# Altium schematic sheet Signals2uC.SchDoc
size A4
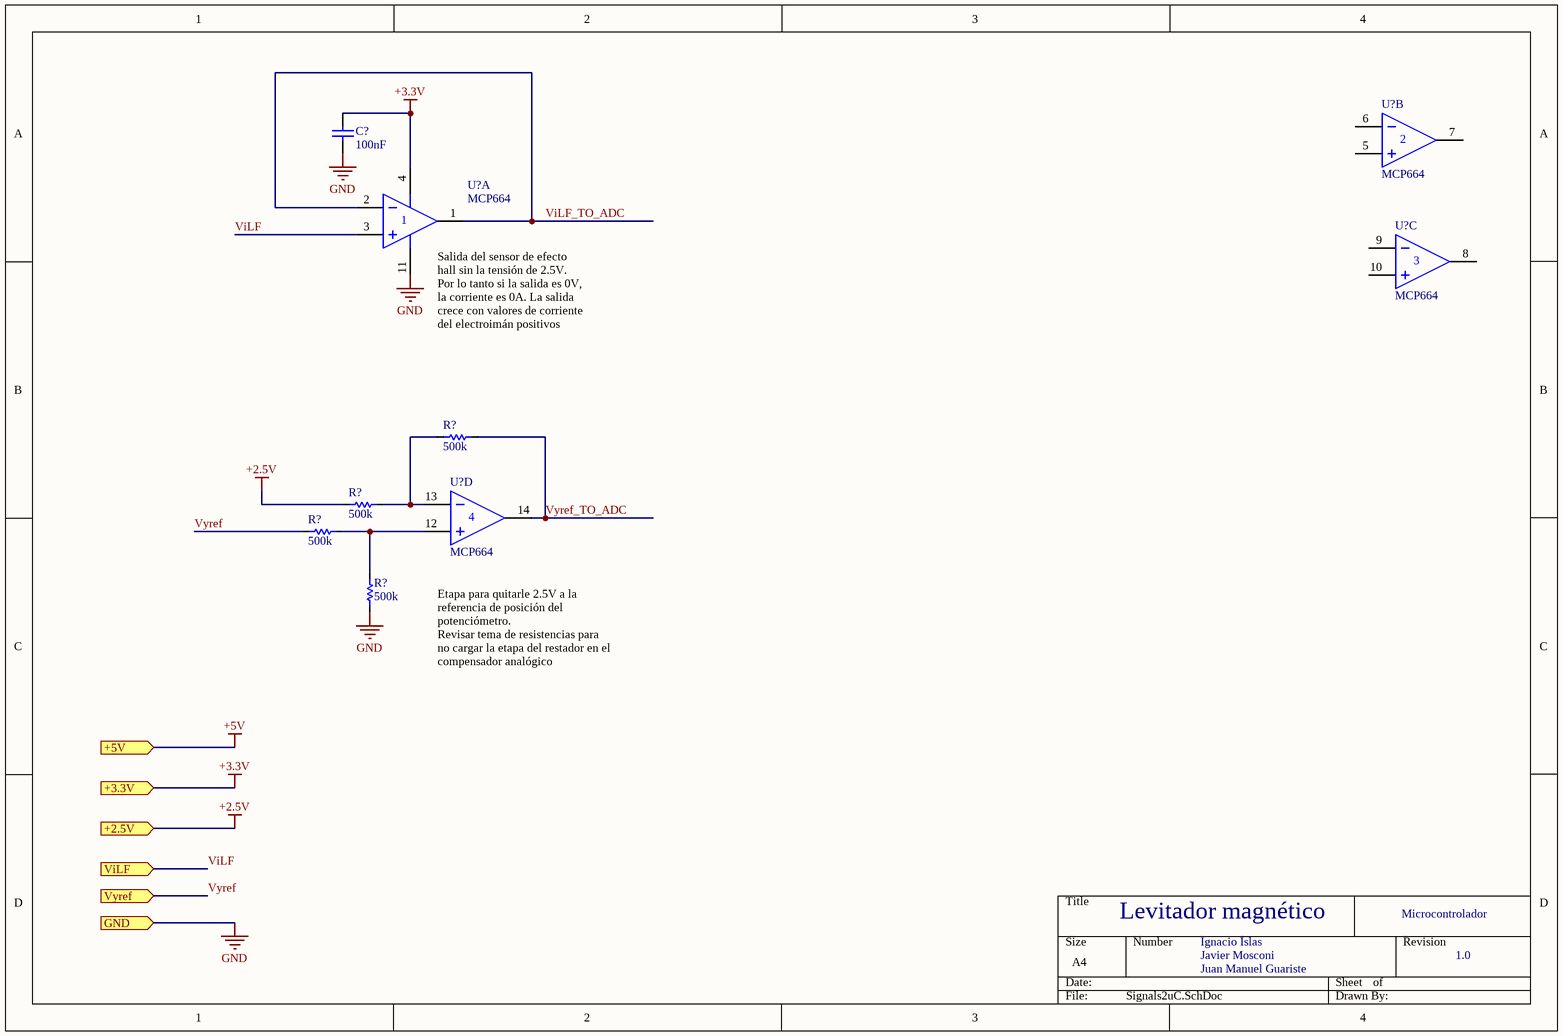
[diagram p0: Signals2uC.SchDoc]

## Parts
(Parts that share a designator on the sheet are numbered #1, #2 ... from top to bottom, then left to right.)
C?  value 100nF  [R2012-0805]  (hidden comment: Capacitor)
R?#1  value 500k  [1206]  (hidden comment: Resistencia)
R?#2  value 500k  [1206]  (hidden comment: Resistencia)
R?#3  value 500k  [1206]  (hidden comment: Resistencia)
R?#4  value 500k  [1206]  (hidden comment: Resistencia)
U?#1  MCP664  [SOIC14]  (part B of 4)
U?#2  MCP664  [SOIC14]  (part A of 4)
U?#3  MCP664  [SOIC14]  (part C of 4)
U?#4  MCP664  [SOIC14]  (part D of 4)

## Ports
+2.5V (in), +3.3V (in), +5V (in), GND (in), ViLF (in), Vyref (in)

## Nets
+2.5V: R?#2.2 ; port +2.5V
+3.3V: C?.1 U?#2.4(V+) ; port +3.3V
+5V: port +5V
GND: C?.2 R?#4.1 U?#2.11(V-) ; port GND
ViLF: U?#2.3(IN+) ; port ViLF
ViLF_TO_ADC: U?#2.1(OUT) U?#2.2(IN-)
Vyref: R?#3.2 ; port Vyref
Vyref_TO_ADC: R?#1.2 U?#4.14(OUT)
NetR?#1_1: R?#1.1 R?#2.1 U?#4.13(IN-)
NetR?#3_1: R?#3.1 R?#4.2 U?#4.12(IN+)

Not connected (* = marked no-connect by the designer): U?#1 5(IN+) 6(IN-) 7(OUT); U?#3 8(OUT) 9(IN-) 10(IN+)

## Notes on the sheet
- (near U?#2) Salida del sensor de efecto hall sin la tensión de 2.5V.
  Por lo tanto si la salida es 0V, la corriente es 0A. La salida crece con valores de corriente del electroimán positivos
- Etapa para quitarle 2.5V a la referencia de posición del potenciómetro.
  Revisar tema de resistencias para no cargar la etapa del restador en el compensador analógico
- Levitador magnético
- Microcontrolador
- Ignacio Islas
- Javier Mosconi
- Juan Manuel Guariste
- 1.0

## Library data of the parts
C? = Capacitor: Manufacturer: Generic Components; Class: Passive; Published: 08/06/2000; Publisher: Altium Hobart Technology Centre; SubClass: Capacitor
R?#1-R?#4 = Resistencia: Manufacturer: Generic Components; Class I: Passive; Class II: Resistor; Published: 8-Jun-2000; Revision: July-2002: Re-released for DXP Platform.; Publisher: Altium Limited
U?#1-U?#4 = MCP664: Datasheet: https://ar.mouser.com/datasheet/2/268/22194B-77503.pdf